# Altium project MB1520.PrjPcb (part 5 of 5)
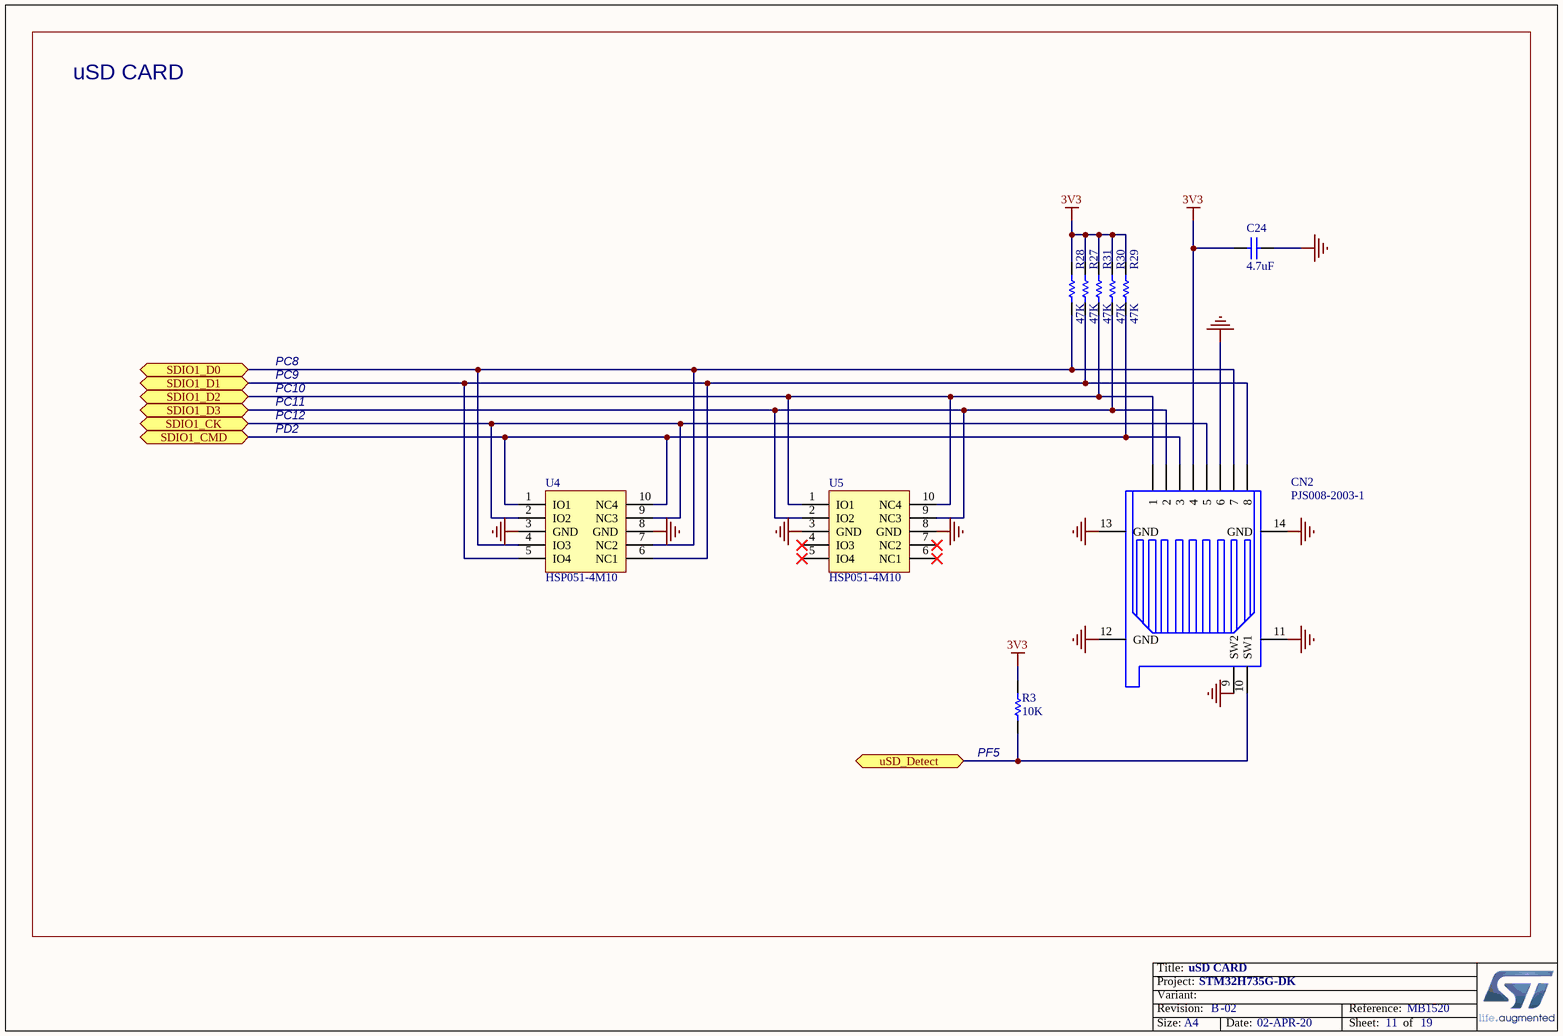
[diagram p18: SD CARD.SchDoc]

## Nets that join several sheets
1V8: STM32 microcontroller Power (C93.2 TP4.1 U14.5), Audio (6 pins)
3V3: STM32 microcontroller Power (9 pins), TAG (CN21.1), Audio (13 pins), USB OTG FS (R117.2 R118.2 R132.2), Arduino Connector (CN5.2 CN5.4 R145.2), STMod+ (9 pins), STM32 microcontroller IOs (5 pins), Ethernet (8 pins), FDCAN (6 pins), STlink_V3E_Module (CN7.3 R112.2), OCSPI (8 pins), LCD (C116.1 CN19.50), HyperRAM (7 pins), SD CARD (8 pins)
3V3_STLK: STlink_V3E_Module (6 pins), STlink_V3E_PWR (39 pins)
5V: STM32 microcontroller Power (C107.2 U1.1 U1.2 U17.3), USB OTG FS (U24.5), Arduino Connector (CN5.5), STMod+ (P2.6 P2.15), FDCAN (6 pins), STlink_V3E_Module (R107.1), STlink_V3E_PWR (6 pins), LCD (R138.1)
5V_POE: PoE (7 pins), STlink_V3E_PWR (D10.1 JP7.5)
5V_USB_CHGR: STlink_V3E_Module (C115.2 CN15.1 U30.1), STlink_V3E_PWR (6 pins)
E5V: STM32 microcontroller Power (C94.2 U15.2 U15.4), Arduino Connector (R72.1), STlink_V3E_PWR (D9.1 JP7.7)
POE7: STM32 microcontroller Power (86 pins), TAG (CN21.3 CN21.5), Audio (36 pins), USB OTG FS (12 pins), Arduino Connector (6 pins), STMod+ (8 pins), STM32 microcontroller IOs (14 pins), Ethernet (16 pins), PoE (16 pins), FDCAN (15 pins), STlink_V3E_Module (28 pins), STlink_V3E_PWR (71 pins), OCSPI (6 pins), LCD (10 pins), HyperRAM (7 pins), SD CARD (11 pins)
USB_FS_VBUS: USB OTG FS (5 pins), STM32 microcontroller IOs (U6.D13), STlink_V3E_PWR (D11.1 JP7.3)
VDD_ETH: Ethernet (SB9.2), PoE (C33.2 R42.2 T3.2)
VIN: STM32 microcontroller Power (C97.2 U15.3), Arduino Connector (CN5.8)
VREF+: STM32 microcontroller Power (7 pins), Arduino Connector (C49.2 SB23.2)
ARD_A0: Arduino Connector (CN9.1), STM32 microcontroller IOs (U6.L2)
ARD_A1: Arduino Connector (CN9.2), STM32 microcontroller IOs (U6.N4)
ARD_A2: Arduino Connector (CN9.3), STM32 microcontroller IOs (SB5.1)
ARD_A3: Arduino Connector (CN9.4), STM32 microcontroller IOs (U6.P3)
ARD_A4: Arduino Connector (SB32.1), STM32 microcontroller IOs (SB42.2)
ARD_A5: Arduino Connector (SB33.1), STM32 microcontroller IOs (U6.N2)
ARD_D0: Arduino Connector (CN8.1), STM32 microcontroller IOs (U6.K14)
ARD_D1: Arduino Connector (CN8.2), STM32 microcontroller IOs (U6.K15)
ARD_D2: Arduino Connector (CN8.3), STM32 microcontroller IOs (U6.H13)
ARD_D3: Arduino Connector (CN8.4), STM32 microcontroller IOs (U6.P1)
ARD_D4: Arduino Connector (CN8.5), STM32 microcontroller IOs (U6.G14)
ARD_D5: Arduino Connector (CN8.6), STM32 microcontroller IOs (U6.M12)
ARD_D6: Arduino Connector (CN8.7), STM32 microcontroller IOs (U6.J12)
ARD_D7: Arduino Connector (CN8.8), STM32 microcontroller IOs (U6.F15)
ARD_D8: Arduino Connector (CN4.1), STM32 microcontroller IOs (U6.B2)
ARD_D9: Arduino Connector (CN4.2), STM32 microcontroller IOs (U6.B5)
Audio_Int: Audio (U12.G3), STM32 microcontroller IOs (U6.N8)
CTP_INT: STM32 microcontroller IOs (U6.G15), LCD (CN19.39)
DETECTn: STMod+ (CN20.10), STM32 microcontroller IOs (U6.A10)
FDCAN1_RX: STM32 microcontroller IOs (U6.B12), FDCAN (U22.4)
FDCAN1_TX: STM32 microcontroller IOs (U6.C13), FDCAN (U22.1)
FDCAN2_RX: STM32 microcontroller IOs (U6.C6), FDCAN (U21.4)
FDCAN2_TX: STM32 microcontroller IOs (U6.A5), FDCAN (U21.1)
FDCAN3_RX: STM32 microcontroller IOs (SB29.1), FDCAN (U20.4)
FDCAN3_TX: STM32 microcontroller IOs (SB30.1), FDCAN (U20.1)
I2C4_SCL: Audio (R90.1 U12.H1), LCD (CN19.40)
I2C4_SDA: Audio (R92.1 U12.F3), LCD (CN19.38)
LCD_B0: STM32 microcontroller IOs (U6.C7), LCD (CN19.21)
LCD_B1: STM32 microcontroller IOs (U6.C10), LCD (CN19.23)
LCD_B2: STM32 microcontroller IOs (U6.D9), LCD (CN19.25)
LCD_B3: STM32 microcontroller IOs (U6.B14), LCD (CN19.27)
LCD_B4: STM32 microcontroller IOs (U6.P12), LCD (CN19.29)
LCD_B5: STM32 microcontroller IOs (U6.N5), LCD (CN19.31)
LCD_B6: STM32 microcontroller IOs (U6.A2), LCD (CN19.33)
LCD_B7: STM32 microcontroller IOs (U6.B3), LCD (CN19.35)
LCD_BL_CTRL: STM32 microcontroller IOs (U6.D7), LCD (CN19.43)
LCD_CLK: STM32 microcontroller IOs (U6.G13), LCD (R136.2)
LCD_DE: STM32 microcontroller IOs (U6.P13), LCD (CN19.22)
LCD_DISP: STM32 microcontroller IOs (U6.L13), LCD (CN19.24)
LCD_G0: STM32 microcontroller IOs (U6.M8), LCD (CN19.4)
LCD_G1: STM32 microcontroller IOs (U6.R8), LCD (CN19.6)
LCD_G2: STM32 microcontroller IOs (U6.R7), LCD (CN19.8)
LCD_G3: STM32 microcontroller IOs (U6.R12), LCD (CN19.10)
LCD_G4: STM32 microcontroller IOs (U6.D12), LCD (CN19.12)
LCD_G5: STM32 microcontroller IOs (U6.P4), LCD (CN19.14)
LCD_G6: STM32 microcontroller IOs (U6.D15), LCD (CN19.16)
LCD_G7: STM32 microcontroller IOs (U6.A9), LCD (CN19.18)
LCD_HSYNC: STM32 microcontroller IOs (U6.E14), LCD (CN19.26)
LCD_R0: STM32 microcontroller IOs (U6.B4), LCD (CN19.3)
LCD_R1: STM32 microcontroller IOs (U6.R4), LCD (CN19.5)
LCD_R2: STM32 microcontroller IOs (U6.N13), LCD (CN19.7)
LCD_R3: STM32 microcontroller IOs (U6.M14), LCD (CN19.9)
LCD_R4: STM32 microcontroller IOs (U6.N14), LCD (CN19.11)
LCD_R5: STM32 microcontroller IOs (U6.M13), LCD (CN19.13)
LCD_R6: STM32 microcontroller IOs (U6.C4), LCD (CN19.15)
LCD_R7: STM32 microcontroller IOs (U6.P14), LCD (CN19.17)
LCD_RST: STM32 microcontroller IOs (U6.P15), LCD (SB43.2)
LCD_VSYNC: STM32 microcontroller IOs (U6.P5), LCD (CN19.28)
MEMS_LED: STMod+ (CN20.12), STM32 microcontroller IOs (U6.G12)
NJTRST: TAG (R150.1), STM32 microcontroller IOs (U6.B6)
OCSPI1_CLK: STM32 microcontroller IOs (R83.1), OCSPI (U10.B2)
OCSPI1_DQS: STM32 microcontroller IOs (R101.1), OCSPI (U10.C3)
OCSPI1_IO0: STM32 microcontroller IOs (R95.2), OCSPI (U10.D3)
OCSPI1_IO1: STM32 microcontroller IOs (R91.2), OCSPI (U10.D2)
OCSPI1_IO2: STM32 microcontroller IOs (R100.1), OCSPI (U10.C4)
OCSPI1_IO3: STM32 microcontroller IOs (R98.2), OCSPI (U10.D4)
OCSPI1_IO4: STM32 microcontroller IOs (R99.2), OCSPI (U10.D5)
OCSPI1_IO5: STM32 microcontroller IOs (R96.2), OCSPI (U10.E3)
OCSPI1_IO6: STM32 microcontroller IOs (R93.2), OCSPI (U10.E2)
OCSPI1_IO7: STM32 microcontroller IOs (R87.2), OCSPI (U10.E1)
OCSPI1_NCS: STM32 microcontroller IOs (R82.2), OCSPI (R81.1 U10.C2)
OCSPI2_CLK: STM32 microcontroller IOs (R60.1), HyperRAM (U7.B2)
OCSPI2_DQS: STM32 microcontroller IOs (R53.1), HyperRAM (U7.C3)
OCSPI2_IO0: STM32 microcontroller IOs (R37.1), HyperRAM (U7.D3)
OCSPI2_IO1: STM32 microcontroller IOs (R46.1), HyperRAM (U7.D2)
OCSPI2_IO2: STM32 microcontroller IOs (R52.1), HyperRAM (U7.C4)
OCSPI2_IO3: STM32 microcontroller IOs (R45.1), HyperRAM (U7.D4)
OCSPI2_IO4: STM32 microcontroller IOs (R48.2), HyperRAM (U7.D5)
OCSPI2_IO5: STM32 microcontroller IOs (R38.2), HyperRAM (U7.E3)
OCSPI2_IO6: STM32 microcontroller IOs (R39.2), HyperRAM (U7.E2)
OCSPI2_IO7: STM32 microcontroller IOs (R40.2), HyperRAM (U7.E1)
OCSPI2_NCS: STM32 microcontroller IOs (R66.2), HyperRAM (R65.1 U7.A3)
OSC_25M: STM32 microcontroller IOs (R35.1), Ethernet (R68.1)
PF6: STMod+ (SB10.1 SB17.1), STM32 microcontroller IOs (SB29.2 U6.H1)
PF7: STMod+ (SB7.1 SB14.1), STM32 microcontroller IOs (SB30.2 U6.J3)
PMOD11: STMod+ (P1.7 P2.11), STM32 microcontroller IOs (U6.N15)
PMOD12: STMod+ (P1.8 P2.12), STM32 microcontroller IOs (U6.K1)
PMOD17: STMod+ (CN20.6 P2.17), STM32 microcontroller IOs (U6.P9)
PMOD18: STMod+ (CN20.3 CN20.4 P2.18), STM32 microcontroller IOs (U6.R11)
PMOD19: STMod+ (CN20.5 P2.19), STM32 microcontroller IOs (U6.R9)
PMOD20: STMod+ (CN20.7 P2.20), STM32 microcontroller IOs (U6.N11)
RESET: TAG (R151.1), Arduino Connector (CN5.3), STM32 microcontroller IOs (5 pins), Ethernet (U9.15), STlink_V3E_Module (CN7.12 R108.1 U16.5), OCSPI (SB26.1), LCD (SB44.2), HyperRAM (SB24.1)
RMII_CRS_DV: STM32 microcontroller IOs (U6.N6), Ethernet (R51.2 R56.1)
RMII_MDC: STM32 microcontroller IOs (U6.L3), Ethernet (U9.13)
RMII_MDIO: STM32 microcontroller IOs (U6.R2), Ethernet (R55.1 U9.12)
RMII_REF_CLK: STM32 microcontroller IOs (U6.P2), Ethernet (R67.2 U9.14)
RMII_RX_ER: STM32 microcontroller IOs (U6.N12), Ethernet (R57.1 U9.10)
RMII_RXD0: STM32 microcontroller IOs (U6.R6), Ethernet (R49.1 R58.1)
RMII_RXD1: STM32 microcontroller IOs (U6.M7), Ethernet (R50.1 R59.1)
RMII_TX_EN: STM32 microcontroller IOs (R24.1), Ethernet (U9.16)
RMII_TXD0: STM32 microcontroller IOs (R25.1), Ethernet (U9.17)
RMII_TXD1: STM32 microcontroller IOs (R32.1), Ethernet (U9.18)
SAI1_SD_A: Audio (U12.F2), STM32 microcontroller IOs (U6.E3)
SAI4_CK2: Audio (SB40.2), STM32 microcontroller IOs (U6.D3)
SAI4_D2: Audio (SB39.2), STM32 microcontroller IOs (U6.B1)
SDIO1_CK: STM32 microcontroller IOs (U6.B11), SD CARD (CN2.5 U4.2 U4.9)
SDIO1_CMD: STM32 microcontroller IOs (U6.B10), SD CARD (CN2.3 R29.1 U4.1 U4.10)
SDIO1_D0: STM32 microcontroller IOs (U6.D14), SD CARD (CN2.7 R28.1 U4.4 U4.7)
SDIO1_D1: STM32 microcontroller IOs (U6.E13), SD CARD (CN2.8 R27.1 U4.5 U4.6)
SDIO1_D2: STM32 microcontroller IOs (U6.C12), SD CARD (CN2.1 R31.1 U5.1 U5.10)
SDIO1_D3: STM32 microcontroller IOs (U6.C11), SD CARD (CN2.2 R30.1 U5.2 U5.9)
STMOD#3: STMod+ (SB6.1 SB8.1), STM32 microcontroller IOs (U6.J2)
STMOD#4: STMod+ (SB12.1 SB15.1), STM32 microcontroller IOs (U6.J4)
STMOD#7-SCL: STMod+ (P2.7), STM32 microcontroller IOs (U6.R10)
STMOD#8-MOSIs: STMod+ (P2.8), STM32 microcontroller IOs (U6.N7)
STMOD#9-MISOs: STMod+ (P2.9), STM32 microcontroller IOs (U6.M11)
STMOD#10-SDA: STMod+ (P2.10), STM32 microcontroller IOs (U6.N10)
STMOD#13-ADC: STMod+ (P2.13), STM32 microcontroller IOs (U6.P6)
STMOD#14-PWM: STMod+ (P2.14), STM32 microcontroller IOs (U6.H14)
T_JTDI: TAG (R148.1), STM32 microcontroller IOs (U6.A11), STlink_V3E_Module (CN7.10 U34.1)
T_PWR_EN: STlink_V3E_Module (U13.R5), STlink_V3E_PWR (R127.1 U23.4)
T_SWCLK: TAG (R153.1), STM32 microcontroller IOs (U6.A12), STlink_V3E_Module (CN7.6 JP2.1 R104.1 U16.3)
T_SWDIO: TAG (R152.1), STM32 microcontroller IOs (U6.B13), STlink_V3E_Module (CN7.4 JP2.2 R103.1 U16.4)
T_SWO: TAG (R147.1), STM32 microcontroller IOs (U6.A6), STlink_V3E_Module (CN7.8 R106.1 U16.1)
T_VCP_RX: STM32 microcontroller IOs (U6.K13), STlink_V3E_Module (CN7.13 R114.2 U18.1)
T_VCP_TX: STM32 microcontroller IOs (U6.L14), STlink_V3E_Module (CN7.14 R110.1 U18.3)
USB_FS_DM: USB OTG FS (CN14.2 U25.3), STM32 microcontroller IOs (U6.C15)
USB_FS_DP: USB OTG FS (CN14.3 U25.4), STM32 microcontroller IOs (U6.B15)
USB_FS_ID: USB OTG FS (CN14.4 U25.6), STM32 microcontroller IOs (U6.C14)
USB_FS_OVCR: USB OTG FS (R116.2), STM32 microcontroller IOs (U6.B7)
USB_FS_PWR_EN: USB OTG FS (R128.1), STM32 microcontroller IOs (U6.R5)
uSD_Detect: STM32 microcontroller IOs (U6.H3), SD CARD (CN2.10 R3.1)
USER_LED1: STMod+ (R144.1), STM32 microcontroller IOs (U6.M2)
USER_LED2: STMod+ (R143.1), STM32 microcontroller IOs (U6.M1)
WAKEUP: STMod+ (R141.2), STM32 microcontroller IOs (U6.C1)

## Assembly variants
H725I: not fitted C14 C21 C26 C44 C47 C49 C72 C117 C138 CN6 CN21 JP2 R3 R5 R16 R64 R70 R94 SB1 SB3 SB4 SB6 SB10 SB14 SB15 SB16 SB18 SB19 SB23 SB27 SB28 SB29 SB30 SB31 SB34 SB35 SB37 SB38 T1 U1
H735I: not fitted C14 C21 C26 C44 C47 C49 C72 C117 C138 CN6 CN21 JP2 R3 R5 R16 R64 R70 R94 SB1 SB3 SB4 SB7 SB8 SB12 SB16 SB17 SB18 SB19 SB23 SB27 SB28 SB29 SB30 SB31 SB34 SB35 SB37 SB38 SB41 SB44 T1 U1